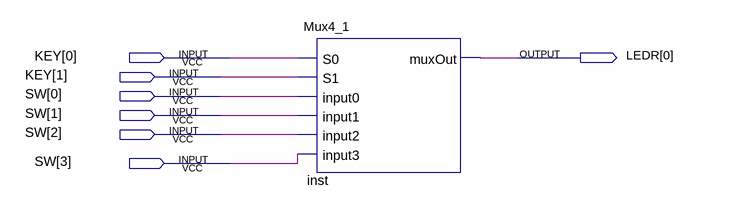
[diagram p0: schematic sheet]
// Quartus schematic Mux4_1Demo.bdf as structural Verilog: 1 symbols, 7 pins
module Mux4_1Demo (
  input  [1:0] KEY,
  input  [3:0] SW,
  output [0:0] LEDR
);

  Mux4_1 inst (
    .S0(KEY[0]), .S1(KEY[1]), .input0(SW[0]), .input1(SW[1]), .input2(SW[2]), .input3(SW[3]), .muxOut(LEDR[0]));
endmodule
